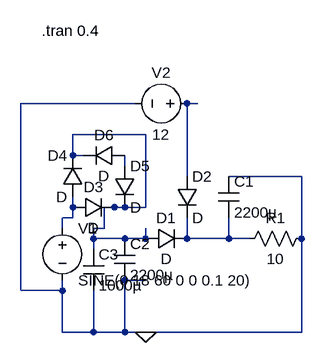
[diagram p0: schematic Draft42.asc]
Draft42.asc, the LTspice schematic file:
Version 4
SHEET 1 880 680
WIRE 384 96 208 96
WIRE 480 96 464 96
WIRE 400 144 288 144
WIRE 288 176 288 144
WIRE 304 176 288 176
WIRE 368 192 368 176
WIRE 464 208 464 96
WIRE 640 208 528 208
WIRE 288 256 288 240
WIRE 352 256 336 256
WIRE 368 256 352 256
WIRE 400 256 400 144
WIRE 400 256 368 256
WIRE 288 272 288 256
WIRE 288 272 272 272
WIRE 272 288 272 272
WIRE 336 288 336 256
WIRE 336 288 320 288
WIRE 320 304 320 288
WIRE 368 304 320 304
WIRE 400 304 400 288
WIRE 400 304 368 304
WIRE 464 304 464 272
WIRE 528 304 528 272
WIRE 528 304 464 304
WIRE 560 304 528 304
WIRE 640 304 640 208
WIRE 320 320 320 304
WIRE 400 368 368 368
WIRE 208 384 208 96
WIRE 272 384 272 368
WIRE 272 384 208 384
WIRE 272 448 272 384
WIRE 320 448 320 384
WIRE 320 448 272 448
WIRE 368 448 368 368
WIRE 368 448 320 448
WIRE 400 448 368 448
WIRE 640 448 640 304
WIRE 640 448 400 448
FLAG 400 448 0
SYMBOL voltage 272 272 R0
SYMATTR InstName V1
SYMATTR Value SINE(0 18 60 0 0 0.1 20)
SYMBOL res 656 288 R90
WINDOW 0 0 56 VBottom 2
WINDOW 3 32 56 VTop 2
SYMATTR InstName R1
SYMATTR Value 10
SYMBOL voltage 480 96 R90
WINDOW 0 -32 56 VBottom 2
WINDOW 3 32 56 VTop 2
SYMATTR InstName V2
SYMATTR Value 12
SYMBOL cap 512 208 R0
SYMATTR InstName C1
SYMATTR Value 2200µ
SYMBOL diode 448 208 R0
SYMATTR InstName D2
SYMBOL diode 304 240 R180
WINDOW 0 24 64 Left 2
WINDOW 3 24 0 Left 2
SYMATTR InstName D4
SYMBOL diode 352 192 R0
SYMATTR InstName D5
SYMBOL diode 368 160 R90
WINDOW 0 0 32 VBottom 2
WINDOW 3 32 32 VTop 2
SYMATTR InstName D6
SYMBOL diode 288 272 R270
WINDOW 0 32 32 VTop 2
WINDOW 3 0 32 VBottom 2
SYMATTR InstName D3
SYMBOL cap 352 304 R0
SYMATTR InstName C2
SYMATTR Value 2200µ
SYMBOL diode 400 320 R270
WINDOW 0 32 32 VTop 2
WINDOW 3 0 32 VBottom 2
SYMATTR InstName D1
SYMBOL cap 304 320 R0
SYMATTR InstName C3
SYMATTR Value 1000µ
TEXT 240 -16 Left 2 !.tran 0.4

The netlist it stands for:
* Draft42.asc
V1 N004 0 SINE(0 18 60 0 0 0.1 20)
R1 0 N005 10
V2 N001 0 12
C1 0 N005 2200µ
D2 N001 N005 D
D4 N004 N002 D
D5 N003 N002 D
D6 N003 N002 D
D3 N004 N002 D
C2 N002 0 2200µ
D1 N002 N005 D
C3 N002 0 1000µ
.model D D
.lib standard.dio
.tran 0.4
.backanno
.end